# EAGLE design ringRemote (EAGLE 8.6.1)
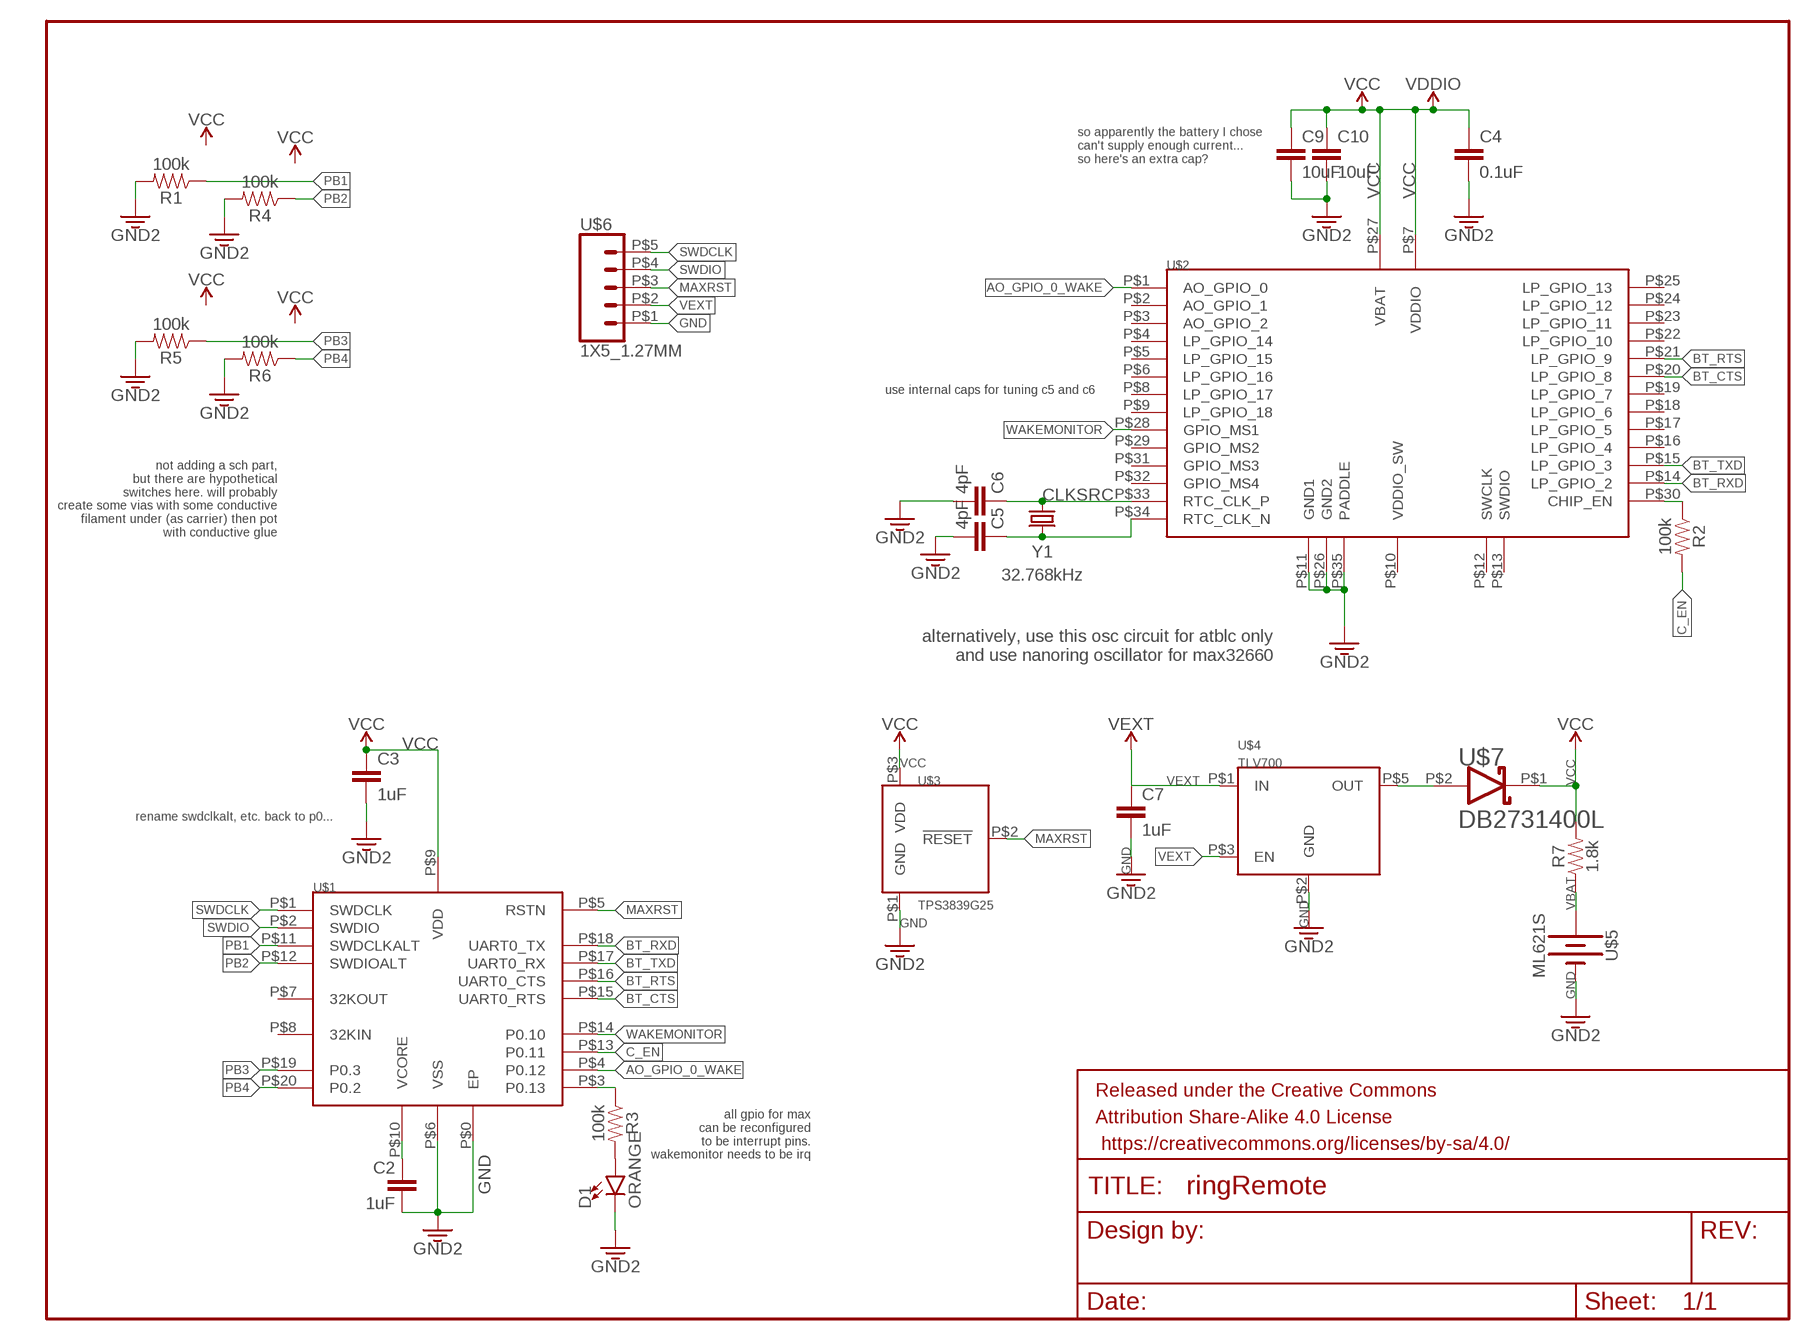
[diagram p0: schematic, sheet 1]

## Parts
C2  1uF  CAPACITOR  [0201]
C3  1uF  CAPACITOR  [0201]
C4  0.1uF  CAPACITOR  [0201]
C5  4pF  CAPACITOR  [0201]
C6  4pF  CAPACITOR  [0201]
C7  1uF  CAPACITOR  [0201]
C9  10uF  CAPACITOR-0402-16V-10%  [0402]
C10  10uF  CAPACITOR-0402-16V-10%  [0402]
D1  ORANGE  LED0201  [LED-0201]
FRAME1  FRAME-LETTERNO_PACKAGE  [DUMMY]
R1  100k  RESISTOR  [0201]
R2  100k  RESISTOR  [0201]
R3  100k  RESISTOR  [0201]
R4  100k  RESISTOR  [0201]
R5  100k  RESISTOR  [0201]
R6  100k  RESISTOR  [0201]
R7  1.8k  RESISTOR0805  [0805]
U$1  MAX32660  [T2044+5C]
U$2  ATBTLC1000-ZR110CA  [ATBTLC1000-ZR110CA]
U$3  TPS3839G25  TPS3839  [3-SOT-23]
U$4  TLV700  [SOT-23-THIN]
U$5  ML621S  [ML621S]
U$6  1X5_1.27MM  [1X5_1.27MM]
U$7  DB2731400L  [SSSMINI2]
Y1  32.768kHz  CRYSTAL-32.768KHZSMD-3.2X1.5  [CRYSTAL-SMD-3.2X1.5MM]

## Nets
AO_GPIO_0_WAKE: U$1.P$4(P0.12) U$2.P$1(AO_GPIO_0)
BT_CTS: U$1.P$15(UART0_RTS) U$2.P$20(LP_GPIO_8)
BT_RTS: U$1.P$16(UART0_CTS) U$2.P$21(LP_GPIO_9)
BT_RXD: U$1.P$18(UART0_TX) U$2.P$14(LP_GPIO_2)
BT_TXD: U$1.P$17(UART0_RX) U$2.P$15(LP_GPIO_3)
C_EN: R2.2 U$1.P$13(P0.11)
CLKSRC: C6.1 U$2.P$33(RTC_CLK_P) Y1.P$1
GND: C2.2 C3.2 C4.2 C5.2 C6.2 C7.2 C9.2 C10.2 D1.C R1.2 R4.2 R5.2 R6.2 U$1.P$0(EP) U$1.P$6(VSS) U$2.P$11(GND1) U$2.P$26(GND2) U$2.P$35(PADDLE) U$3.P$1(GND) U$4.P$2(GND) U$5.P$2(-) U$6.P$1 ; supply symbol labelled GND2
MAXRST: U$1.P$5(RSTN) U$3.P$2(!RESET) U$6.P$3
N$1: C2.1 U$1.P$10(VCORE)
N$2: C5.1 U$2.P$34(RTC_CLK_N) Y1.P$2
N$3: R3.1 U$1.P$3(P0.13)
N$4: R2.1 U$2.P$30(CHIP_EN)
N$5: D1.A R3.2
N$10: U$4.P$5(OUT) U$7.P$2(ANODE)
PB1: R1.1 U$1.P$11(SWDCLKALT)
PB2: R4.1 U$1.P$12(SWDIOALT)
PB3: R5.1 U$1.P$19(P0.3)
PB4: R6.1 U$1.P$20(P0.2)
SWDCLK: U$1.P$1(SWDCLK) U$6.P$5
SWDIO: U$1.P$2(SWDIO) U$6.P$4
VBAT: R7.1 U$5.P$1(+)
VCC: C3.1 C4.1 C9.1 C10.1 R7.2 U$1.P$9(VDD) U$2.P$7(VDDIO) U$2.P$27(VBAT) U$3.P$3(VDD) U$7.P$1(CATHODE) ; supply symbol labelled VDDIO, VEXT
VEXT: C7.1 U$4.P$1(IN) U$4.P$3(EN) U$6.P$2
WAKEMONITOR: U$1.P$14(P0.10) U$2.P$28(GPIO_MS1)
Unconnected: U$1.P$7(32KOUT) U$1.P$8(32KIN) U$2.P$2(AO_GPIO_1) U$2.P$3(AO_GPIO_2) U$2.P$4(LP_GPIO_14) U$2.P$5(LP_GPIO_15) U$2.P$6(LP_GPIO_16) U$2.P$8(LP_GPIO_17) U$2.P$9(LP_GPIO_18) U$2.P$10(VDDIO_SW) U$2.P$12(SWCLK) U$2.P$13(SWDIO) U$2.P$16(LP_GPIO_4) U$2.P$17(LP_GPIO_5) U$2.P$18(LP_GPIO_6) U$2.P$19(LP_GPIO_7) U$2.P$22(LP_GPIO_10) U$2.P$23(LP_GPIO_11) U$2.P$24(LP_GPIO_12) U$2.P$25(LP_GPIO_13) U$2.P$29(GPIO_MS2) U$2.P$31(GPIO_MS3) U$2.P$32(GPIO_MS4)

## Notes on the sheet
- so apparently the battery I chose
  can't supply enough current...
  so here's an extra cap?
- use internal caps for tuning c5 and c6
- not adding a sch part,
  but there are hypothetical
  switches here. will probably
  create some vias with some conductive
  filament under (as carrier) then pot
  with conductive glue
- alternatively, use this osc circuit for atblc only
  and use nanoring oscillator for max32660
- rename swdclkalt, etc. back to p0...
- all gpio for max
  can be reconfigured
  to be interrupt pins.
  wakemonitor needs to be irq

## Library data of the parts
C2-C7 = ringRemote:CAPACITOR: 0.1µF ceramic capacitors A capacitor is a passive two-terminal electrical component used to store electrical energy temporarily in an electric field.
C9 C10 = ringRemote:CAPACITOR: 0.1µF ceramic capacitors A capacitor is a passive two-terminal electrical component used to store electrical energy temporarily in an electric field.; PROD_ID: CAP-12416; VALUE: 0.1uF
D1 = ringRemote:LED: LED (Generic) Standard schematic elements and footprints for 5mm, 3mm, 1206, and 0603 sized LEDs. Generic LEDs with no color specified.
FRAME1 = SparkFun-Aesthetics:FRAME-LETTER: Schematic Frame - Letter Standard 8.5x11 US Letter frame; DESIGNER: Nobody; VERSION: v01
R1-R7 = ringRemote:RESISTOR: Generic Resistor Package
U$1 = ringRemote:MAX32660
U$2 = ringRemote:ATBTLC1000-ZR110CA
U$3 = ringRemote:TPS3839
U$4 = ringRemote:TLV700
U$5 = ringRemote:ML621S
U$6 = ringRemote:1X5_1.27MM
U$7 = ringRemote:DB2731400L
Y1 = ringRemote:CRYSTAL-32.768KHZ: 32.768kHz Crystal Frequency: 32.768kHz Frequency Stability: ±20ppm Load Capacitance: 12.5pF (PTH-2X6 & SMD-3.2X1.5), 6pF (SMD-2X6) SparkFun Products: SparkFun BigTime Watch Kit <https://www.sparkfun.com/products/11734> SparkFun nRF52832 Breakout <https://www.sparkfun.com/products/13990> SparkFun Real Time Clock Module <https://www.sparkfun.com/products/12708>; PROD_ID: XTAL-13062

## Board
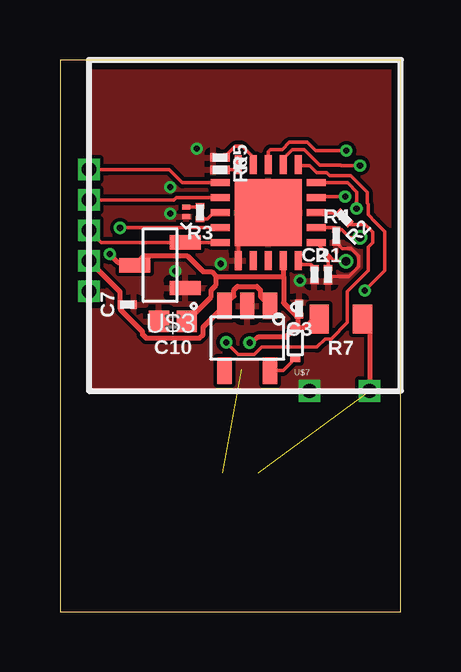
[diagram p1: board, top side]
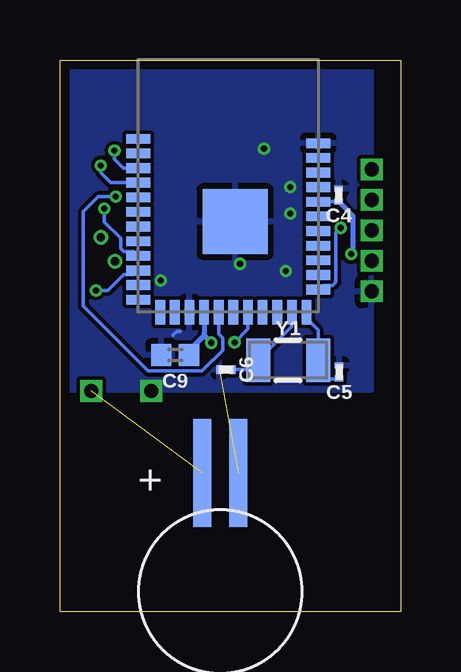
[diagram p2: board, bottom side, seen from below]

Size 14.2 x 23 mm. Coordinates in mm from the lower left corner, seen from the top.
Outline: 0,0 14.2,0 14.2,23 0,23 0,0
Copper layers (1*16): Top 0.035559375mm / dielectric 1.6mm / Bottom 0.035559375mm
Design rules "oshpark-2layer": minimum track width 6mil, minimum drill 10mil, track to track 6mil, track to pad 6mil, pad to pad 6mil, via to via 6mil, smd to smd 6mil, copper to edge 15mil, drill to drill 6mil, minimum pad ring 5mil, minimum via ring 5mil, stop-mask expansion 2.5mil, vias tented up to drill 0mil, thermal gap 10mil
tKeepout: area 3.4,20 to 11,23

### Footprints (pad centres in the part's own frame; a part is rotated, then mirrored left to right if it is on the bottom)
0201 = smd 0.35 x 0.25: 1 0,0.275; 2 0,-0.275
0402 = smd 0.85 x 0.9: 1 -0.58,0; 2 0.58,0
LED-0201 = smd 0.2 x 0.35: A -0.2,0; C 0.2,0
0805 = smd 0.8 x 1.2: 1 -0.9,0; 2 0.9,0
T2044+5C = smd 2.8 x 2.8: P$0 0,0 | smd 0.3 x 0.8: P$1 -1.25,-2; P$2 -0.625,-2; P$3 0,-2; P$4 0.625,-2; P$5 1.25,-2; P$11 1.25,2; P$12 0.625,2; P$13 0,2; P$14 -0.625,2; P$15 -1.25,2 | smd 0.8 x 0.3: P$6 2,-1.25; P$7 2,-0.625; P$8 2,0; P$9 2,0.625; P$10 2,1.25; P$16 -2,1.25; P$17 -2,0.625; P$18 -2,0; P$19 -2,-0.625; P$20 -2,-1.25
ATBTLC1000-ZR110CA = smd 1.016 x 0.406: P$1 3.462,-2.836; P$2 3.462,-2.225; P$3 3.462,-1.615; P$4 3.462,-1.006; P$5 3.462,-0.396; P$6 3.462,0.214; P$7 3.462,0.825; P$8 3.462,1.435; P$9 3.462,2.045; P$10 3.462,2.655; P$11 3.462,3.264; P$12 -4.042,3.453; P$13 -4.042,2.842; P$14 -4.042,2.232; P$15 -4.042,1.623; P$16 -4.042,1.012; P$17 -4.042,0.403; P$18 -4.042,-0.207; P$19 -4.042,-0.818; P$20 -4.042,-1.427; P$21 -4.042,-2.038; P$22 -4.042,-2.647; P$23 -4.042,-3.257 | smd 0.406 x 1.016: P$24 -3.127,-3.776; P$25 -2.518,-3.776; P$26 -1.907,-3.776; P$27 -1.298,-3.776; P$28 -0.688,-3.776; P$29 -0.077,-3.776; P$30 0.532,-3.776; P$31 1.143,-3.776; P$32 1.752,-3.776; P$33 2.362,-3.776; P$34 2.973,-3.776 | smd 2.705 x 2.705: P$35 0,0
3-SOT-23 = smd 1.3 x 0.6: P$1 -1.05,0.95; P$2 -1.05,-0.95; P$3 1.05,0
SOT-23-THIN = smd 0.6 x 1.1: P$1 -0.95,-1.35; P$2 0,-1.35; P$3 0.95,-1.35; P$4 0.95,1.35; P$5 -0.95,1.35
ML621S = smd 0.75 x 4.5: P$1 0.75,-4.95; P$2 -0.75,-4.95
1X5_1.27MM = drill 0.6 pad 0.813 square: P$1 -2.54,0; P$2 -1.27,0; P$3 0,0; P$4 1.27,0; P$5 2.54,0
SSSMINI2 = smd 0.4 x 0.3: P$1 0,-0.65; P$2 0,0.65
CRYSTAL-SMD-3.2X1.5MM = smd 1 x 1.8: P$1 -1.25,0; P$2 1.25,0

### Placement (x,y rotation side)
C2  10.6,14.05 0 top
C3  9.96,12.62 180 top
C4  2.59,17.36 180 bottom
C5  2.57,9.99 180 bottom
C6  7.28,10.09 270 bottom
C7  2.8,12.8 90 top
C9  9.4,10.7 180 bottom
C10  4.7,12.1 180 top
D1  5.26,16.67 270 top
FRAME1  -6,-10.4 0 top  (outside the outline)
R1  11.17,14.04 0 top
R2  11.83,16.42 225 top
R3  5.83,16.64 180 top
R4  11.51,15.66 0 top
R5  6.67,18.93 270 top
R6  6.67,18.42 270 top
R7  11.7,12.2 180 top
U$1  8.68,16.63 270 top
U$2  6.9,16.26 0 bottom
U$3  4.17,14.44 180 top
U$4  7.8,11.4 180 top
U$5  7.52,0.83 180 bottom
U$6  1.21,15.89 90 top
U$7  9.8,11.2 180 top
Y1  4.7,10.48 0 bottom

### Tracks (layer width: path | path; a pad name or v marks a point on that pad's centre or on a via)
AO_GPIO_0_WAKE  (via drill 0.25)
  Top 0.152: v2.5,16 U$1.P$4
  Bottom 0.152: U$2.P$1 3.26,13.6 2.84,13.6 2.7,13.74 2.7,15.8 v2.5,16
BT_CTS  (via drill 0.25)
  Top 0.152: v12.35,16.8 12.35,17.09 12.36,17.1 12.36,17.5 11.98,17.88 U$1.P$15
  Bottom 0.152: U$2.P$20 11.12,15.01 11.54,15.01 11.68,15.14 11.68,15.57 12.35,16.25 v12.35,16.8
BT_RTS  (via drill 0.25)
  Top 0.152: U$1.P$16 9.96,18.6 10.4,18.6 10.69,18.31 11.12,18.31 11.25,18.18 12.11,18.18 12.8,17.5 12.8,17.04 12.84,17 12.84,16.55 13.14,16.24 13.54,15.85 13.54,14.22 v12.7,13.39
  Bottom 0.152: U$2.P$21 11.12,14.04 11.54,14.04 12.2,13.39 v12.7,13.39
BT_RXD  (via drill 0.25)
  Top 0.152: U$1.P$18 8.68,19.18 8.76,19.26 9.25,19.26 9.56,19.56 10.3,19.56 10.65,19.21 v11.93,19.21
  Bottom 0.152: U$2.P$14 11.56,18.49 11.93,18.87 v11.93,19.21
BT_TXD  (via drill 0.25)
  Top 0.152: U$1.P$17 9.3,18.88 9.68,19.26 10.17,19.26 10.82,18.62 11.7,18.62 11.72,18.6 v12.5,18.6
  Bottom 0.152: U$2.P$15 12.08,17.88 12.5,18.3 v12.5,18.6
C_EN
  Top 0.152: U$1.P$13 10.7,16.61 R2.2
CLKSRC
  Bottom 0.152: U$2.P$33 4.54,11.89 Y1.P$1 5.7,10.23 5.7,10 5.79,10.09 C6.1
GND  (via drill 0.25, 0.6)  (1 unrouted)
  Top 0.152: U$1.P$6 7.43,15.38 U$1.P$0 | 4.56,17.66 v4.6,17.7 | R1.2 11.37,13.96 12.02,13.96 12.44,14.38 12.44,14.82 12.13,15.13 11.76,15.13 R4.2
  Bottom 0.152: 5.7,19.1 v5.7,19.3 | 9.47,11.51 9.47,11.54 9.34,11.68 9.19,11.68 | 8.81,12.06 U$2.P$26
  other vias: 4.6,16.6 10.4,9.2 10,13.8 6.7,14.5 4.8,14.2
  pour Top (rank 4): 1.2,23 14.2,23 14.2,9.2 1.2,9.2
  pour Bottom: 1.2,23 14.2,23 14.2,9.2 1.2,9.2
MAXRST
  Top 0.152: U$1.P$5 5.09,15.38 U$3.P$2 | U$3.P$2 4.91,15.39 | U$3.P$2 1.71,15.39 U$6.P$3
  Bottom 0.152: 1.24,15.86 U$6.P$3
N$1
  Top 0.152: C2.1 10.46,14.47 10.09,14.47 U$1.P$10
N$2
  Bottom 0.152: U$2.P$34 3.93,12.23 3.45,11.75 Y1.P$2 3.45,9.85 3.3,9.7 2.58,9.7 C5.1
N$3
  Top 0.152: R3.1 6.13,16.36 6.4,16.63 U$1.P$3
N$4  (via drill 0.25)
  Top 0.152: v6.93,11.23 7.43,10.73 8.1,10.73 8.4,11.03 10.7,11.03 11.04,11.37 11.29,11.37 11.97,12.05 11.97,13.34 12.85,14.22 12.85,15.2 13.03,15.38 13.03,15.82 12.72,16.13 12.12,16.13 R2.1
  Bottom 0.152: U$2.P$30 6.37,11.79 v6.93,11.23
N$5
  Top 0.152: D1.A 5.79,16.87 R3.2
N$10
  Top 0.152: U$4.P$5 9.3,10.05 U$7.P$2
PB1  (via drill 0.35)
  Top 0.152: 10.38,15.32 10.62,15.32 U$1.P$11 11.17,14.89 | v11.91,14.6 11.86,14.65 11.41,14.65 11.17,14.89 | R1.1 11.17,14.89
PB2  (via drill 0.35)
  Top 0.152: U$1.P$12 11.44,16 R4.1 11.74,15.94 12.08,15.6 v12.5,15.6
PB3
  Top 0.152: R5.1 6.95,19.05 7.3,19.4 7.5,19.4 7.6,19.4 8.05,18.95 U$1.P$19
PB4
  Top 0.152: R6.1 7.43,18.42 U$1.P$20
SWDCLK
  Top 0.152: U$1.P$1 5.1,17.88 4.55,18.43 U$6.P$5 1.66,18.43 2,18.43
SWDIO
  Top 0.152: 6.67,17.27 U$1.P$2 6.11,17.25 6.1,17.27 4.85,17.27 4.74,17.16 U$6.P$4
VBAT  (via drill 0.6)  (1 unrouted)
  Top 0.203: R7.1 12.9,12.4 v12.9,9.2
VCC  (via drill 0.25)
  Top 0.152: 9.3,13.99 9.32,13.98
  Top 0.203: 9.32,13.98 9.32,14.62 U$1.P$9 | 9.32,13.98 9.32,12.87 9.9,12.29 | 9.9,11.85 U$7.P$1 9.4,11.45 8.25,11.45 8.21,11.41 v7.9,11.21 | 9.9,11.85 10.23,11.85 10.49,12.11 10.6,12.11 10.9,12.41 R7.2 | C3.1 9.9,12.29 | 9.9,12.29 9.9,11.85 | 3.24,14.56 U$3.P$3 3.06,14.5 | 3.24,14.56 3.52,14.84 5.3,14.84 5.97,14.17 6.31,14.17 6.51,13.98 | 6.51,13.98 9.32,13.98 | v2.07,14.9 2.41,14.56 3.24,14.56 | C10.1 6.3,13.12 6.3,13.4 6.51,13.62 6.51,13.98
  Bottom 0.152: C4.1 U$2.P$7
  Bottom 0.203: 8.2,11.6 U$2.P$27 8.2,11.51 | C4.1 1.99,16.49 1.99,14.98 v2.07,14.9 | 8.2,11.51 v7.9,11.21 | 8.2,11.51 8.71,11 C9.1
VEXT
  Top 0.203: U$6.P$2 2.5,13.33 2.5,12.82 C7.1 2.52,12.57 3.44,11.66 3.44,11.54 3.59,11.4 5.81,11.4 5.96,11.54 5.96,11.86 U$4.P$3 | 6.73,12.82 U$4.P$3 | U$4.P$3 7.25,13.15 7.25,13.4 7.4,13.55 8.21,13.55 8.35,13.4 8.35,13.15 U$4.P$1 | 6.8,12.8 U$4.P$3
WAKEMONITOR  (via drill 0.25)
  Top 0.152: 11.69,17.3 10.72,17.3 | 10.72,17.3 U$1.P$14 | v11.88,17.3 10.72,17.3
  Bottom 0.152: U$2.P$28 7.59,11.58 7.42,11.41 7.42,10.88 7.85,10.45 7.87,10.45 8.3,10.02 10.52,10.02 13.23,12.73 13.23,14.3 13.23,16.67 12.6,17.3 | v11.88,17.3 12.6,17.3 | 12.6,17.3